# Altium project Pack_BMS_Module.PrjPcb
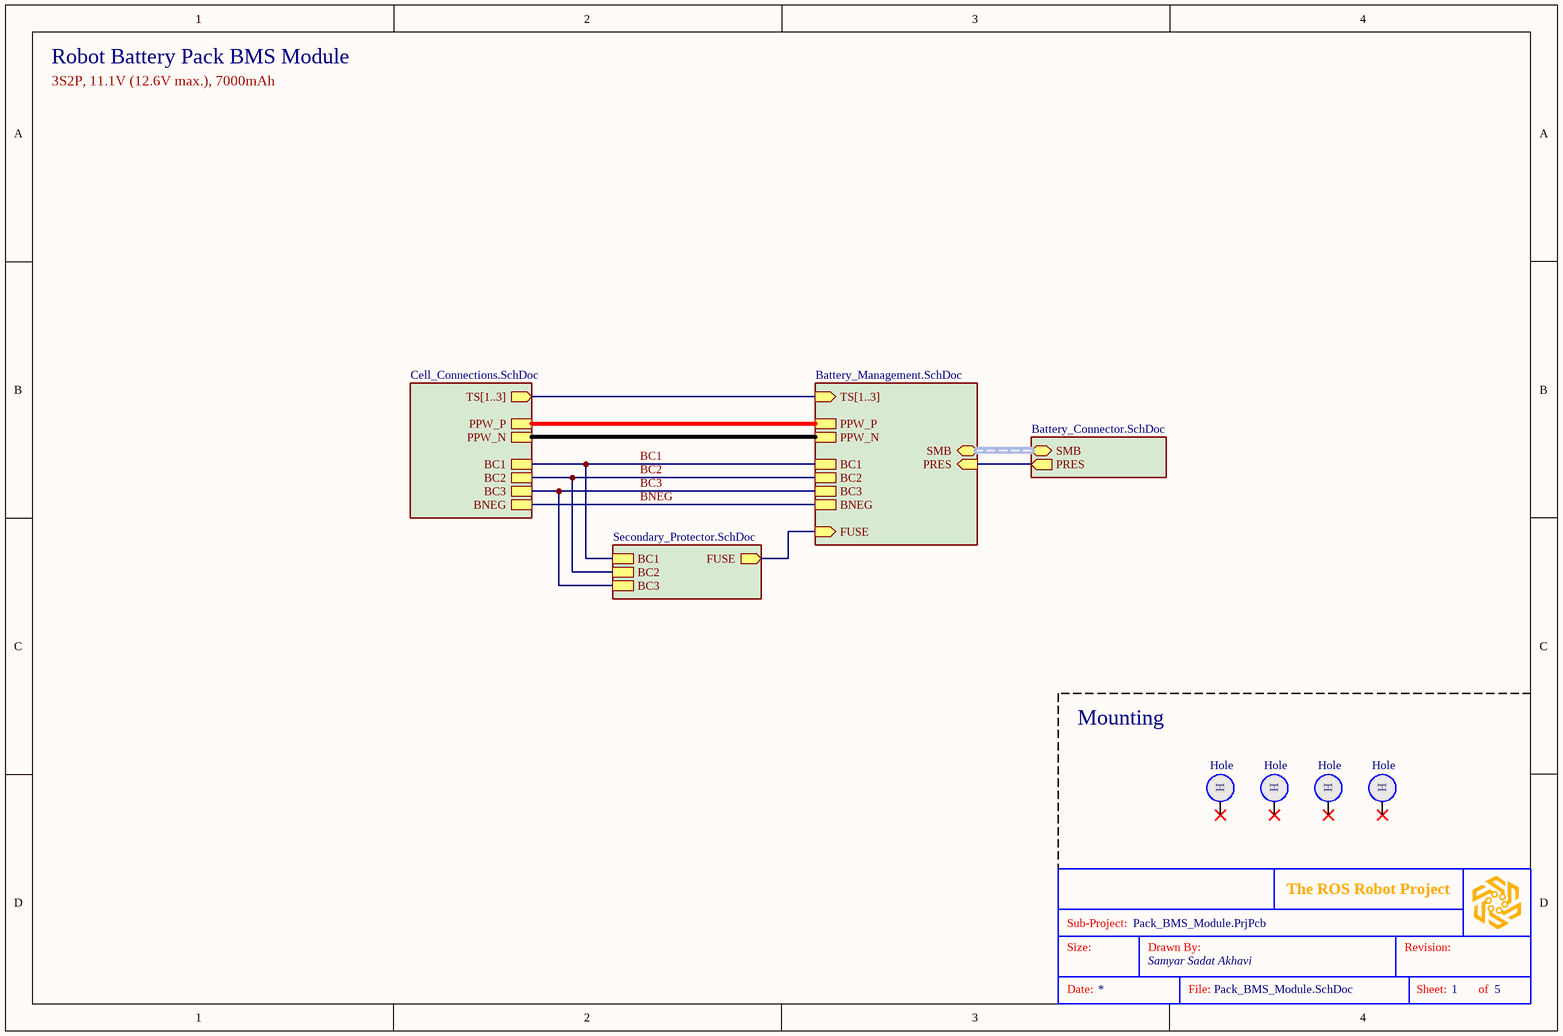
[diagram p0: Pack_BMS_Module.SchDoc]
MainProjectName: The ROS Robot Project
5 sheets, 99 parts. Net scope: hierarchical (ports join the sheet entries above them; power ports are global).
Board file: Pack_BMS_Module.PcbDoc
Sheets:
  Pack_BMS_Module.SchDoc
    CELL_CONN = Cell_Connections.SchDoc
    BATT_MGMT = Battery_Management.SchDoc
    SEC_PROT = Secondary_Protector.SchDoc
    BATT_CONN = Battery_Connector.SchDoc

## Sheet Pack_BMS_Module.SchDoc: =SheetTitle
size A4; SheetTitle: Pack BMS Module; DrawnBy: Samyar Sadat Akhavi; SheetNumber: 1; SheetTotal: 5

### Parts
(Parts that share a designator on the sheet are numbered #1, #2 ... from top to bottom, then left to right.)
?#1  (no value)  (graphical)
MHL1  Hole  [Hole_2.6mm]  (no BOM)
MHL2  Hole  [Hole_2.6mm]  (no BOM)
MHL3  Hole  [Hole_2.6mm]  (no BOM)
MHL4  Hole  [Hole_2.6mm]  (no BOM)

### Sub-sheets
BATT_CONN = Battery_Connector.SchDoc: PRES (out), SMB (bidir, harness SMBus)
BATT_MGMT = Battery_Management.SchDoc: BC2, BC1, BNEG, BC3, FUSE (in), TS[1..3] (in), PPW_N, PPW_P, PRES (in), SMB (bidir, harness SMBus)
CELL_CONN = Cell_Connections.SchDoc: BC1, BC2, BC3, BNEG, TS[1..3] (out), PPW_N, PPW_P
SEC_PROT = Secondary_Protector.SchDoc: BC2, BC1, BC3, FUSE (out)

### Nets
BC1: sheet CELL_CONN/BC1, sheet BATT_MGMT/BC1, sheet SEC_PROT/BC1
BC2: sheet CELL_CONN/BC2, sheet BATT_MGMT/BC2, sheet SEC_PROT/BC2
BC3: sheet CELL_CONN/BC3, sheet BATT_MGMT/BC3, sheet SEC_PROT/BC3
BNEG: sheet CELL_CONN/BNEG, sheet BATT_MGMT/BNEG
PPW_N: sheet CELL_CONN/PPW_N, sheet BATT_MGMT/PPW_N
PPW_P: sheet CELL_CONN/PPW_P, sheet BATT_MGMT/PPW_P
NetR1_2: sheet BATT_MGMT/PRES, sheet BATT_CONN/PRES
NetR16_1: sheet BATT_MGMT/FUSE, sheet SEC_PROT/FUSE

Not connected (* = marked no-connect by the designer): MHL1 1*; MHL2 1*; MHL3 1*; MHL4 1*

### Buses and harness runs
bus sheet BATT_MGMT/TS[1..3] = sheet CELL_CONN/TS[1..3]
harness sheet BATT_CONN/SMB = sheet BATT_MGMT/SMB

### Notes on the sheet
- Robot Battery Pack BMS Module
- 3S2P, 11.1V (12.6V max.), 7000mAh
- Mounting
- Sub-Project:
- Size:
- Drawn By:
- Revision:
- Date:
- File:
- Sheet:
- of
- (in symbol GEN-PCBMHL2S6) H

### Library data of the parts
?#1 = SGR-STDTBSA4: STANDARD SCHEMATICS TITLE BLOCK
MHL1-MHL4 = GEN-PCBMHL2S6: CIRCULAR PCB MOUNTING HOLE; Part Number: GEN-PCBMHL2S6; Size Variant: 2.6mm

## Sheet Cell_Connections.SchDoc: =SheetTitle
size A4; SheetTitle: Cell Connections; DrawnBy: Samyar Sadat Akhavi
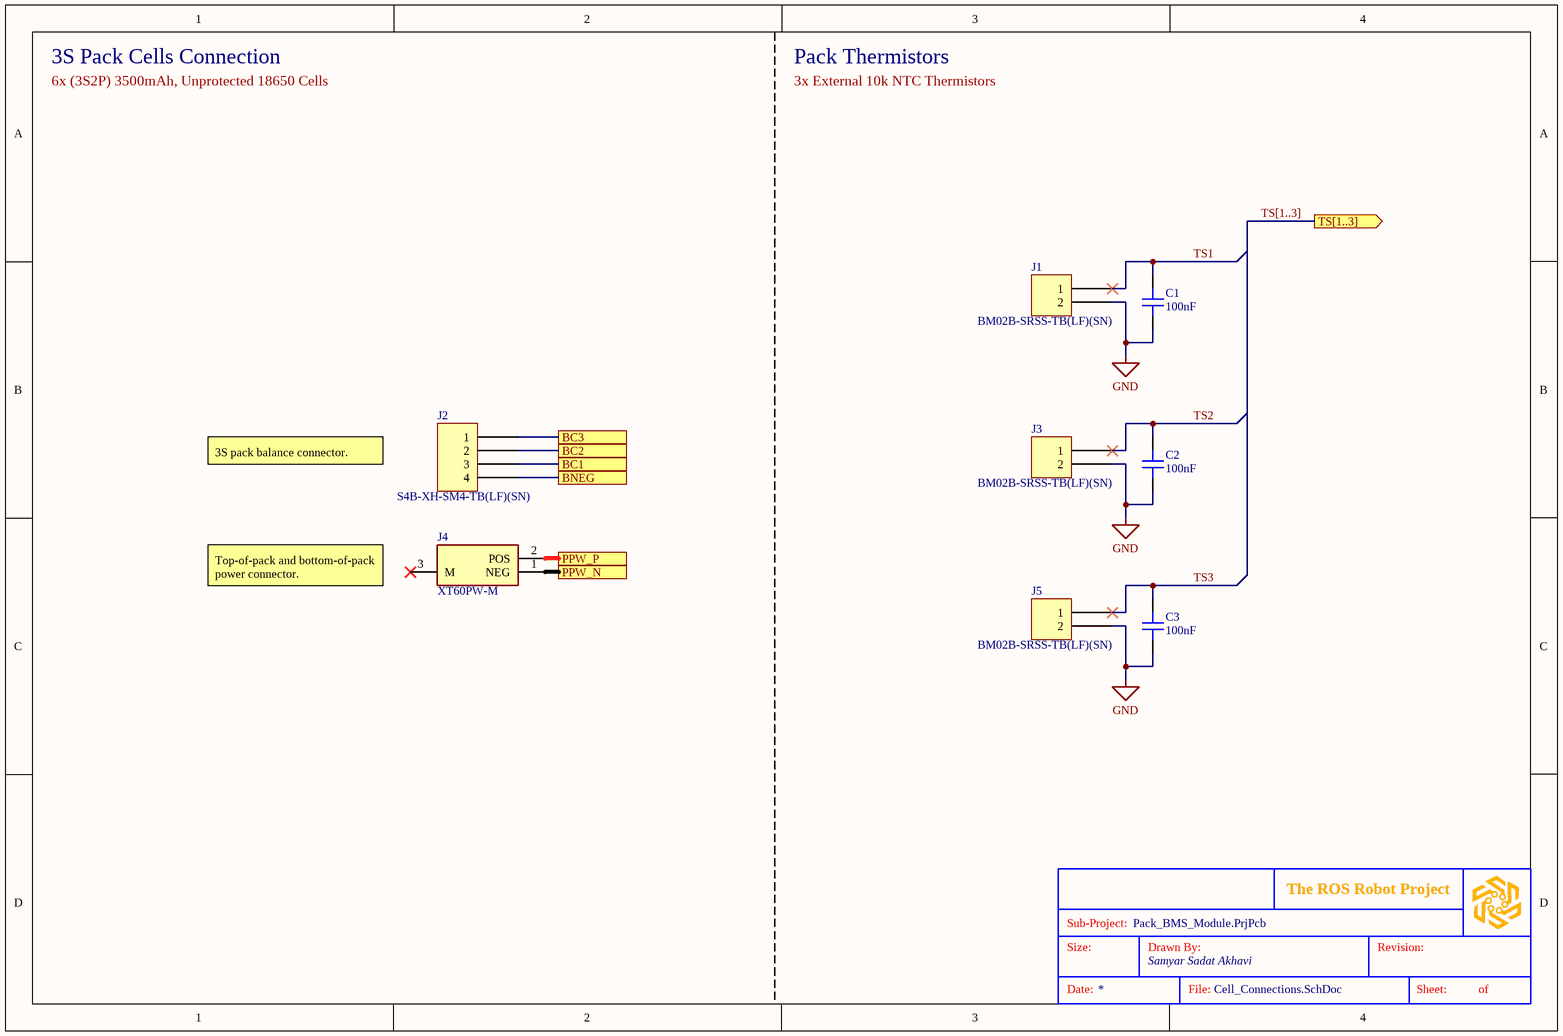
[diagram p1: Cell_Connections.SchDoc]

### Parts
(Parts that share a designator on the sheet are numbered #1, #2 ... from top to bottom, then left to right.)
?#2  (no value)  (graphical)
C1  100nF  [CAP 0603_1608]
C2  100nF  [CAP 0603_1608]
C3  100nF  [CAP 0603_1608]
J1  BM02B-SRSS-TB(LF)(SN)  [JST BM02B-SRSS-TB]
J2  S4B-XH-SM4-TB(LF)(SN)  [JST XH S4B-XH-SM4-TB]
J3  BM02B-SRSS-TB(LF)(SN)  [JST BM02B-SRSS-TB]
J4  XT60PW-M  [XT60PWM]
J5  BM02B-SRSS-TB(LF)(SN)  [JST BM02B-SRSS-TB]

### Ports
BC1 (see Pack_BMS_Module[2B], Battery_Management[1C], Secondary_Protector[2C]), BC2 (see Pack_BMS_Module[2B], Battery_Management[1C], Secondary_Protector[2B]), BC3 (see Pack_BMS_Module[2B], Battery_Management[1C], Secondary_Protector[2B]), BNEG (see Pack_BMS_Module[2B], Battery_Management[1C]), PPW_N (see Pack_BMS_Module[2B], Battery_Management[1C]), PPW_P (see Pack_BMS_Module[2B], Battery_Management[1C]), TS[1..3] (out, see Pack_BMS_Module[2B], Battery_Management[4C])

### Nets
GND: C1.1 C2.1 C3.1 J1.2 J3.2 J5.2
BC1: J2.3 ; port BC1
BC2: J2.2 ; port BC2
BC3: J2.1 ; port BC3
BNEG: J2.4 ; port BNEG
PPW_N: J4.1(NEG) ; port PPW_N
PPW_P: J4.2(POS) ; port PPW_P
TS1: C1.2 J1.1
TS2: C2.2 J3.1
TS3: C3.2 J5.1

Not connected (* = marked no-connect by the designer): J4 3(M)*

### Buses and harness runs
bus TS[1..3] = port TS[1..3]

### Notes on the sheet
- 3S Pack Cells Connection
- 6x (3S2P) 3500mAh, Unprotected 18650 Cells
- Pack Thermistors
- 3x External 10k NTC Thermistors
- 3S pack balance connector.
- Top-of-pack and bottom-of-pack power connector.
- Sub-Project:
- Size:
- Drawn By:
- Revision:
- Date:
- File:
- Sheet:
- of

### Library data of the parts
?#2 = SGR-STDTBSA4: STANDARD SCHEMATICS TITLE BLOCK
C1-C3 = GEN-CC100NT10V25KX7R603: GENERIC 0603 MLC CAPACITOR; Tolerance: ±10%; Voltage: 25V; Dielectric: X7R; Part Number: GEN-CC100NT10V25KX7R603; Value: 100nF
J1 J3 J5 = BM02B-SRSS-TB(LF)(SN): CONN HEADER SMD 2POS 1MM; Manufacturer: JST Sales America Inc.; Current Rating (Amps): 0.7A; Material Flammability Rating: UL94 V-0; Number of Positions: 2; Number of Positions Loaded: All; Pitch - Mating: 0.039" (1.00mm); Shrouding: Shrouded - 4 Wall; Style: Board to Cable/Wire; Voltage Rating: 50V; Part Number: BM02B-SRSS-TB(LF)(SN); ComponentLink1Description: Datasheet; ComponentLink1URL: http://www.jst-mfg.com/product/pdf/eng/eSR.pdf; ComponentLink2Description: DigiKey Link; ComponentLink2URL: http://digikey.com/product-detail/en/jst-sales-america-inc/BM02B-SRSS-TB-LF-SN/455-1788-1-ND/926859; Connector Type: Header; Contact Finish - Mating: Tin; Contact Finish - Post: Tin; Contact Material: Copper Alloy; Contact Shape: Square; Contact Type: Male Pin; Fastening Type: Push-Pull; Features: Solder Retention; Insulation Color: Natural; Insulation Height: 0.167" (4.25mm); Insulation Material: Polyamide (PA), Nylon; LastUpdated: 1/12/2020 10:11:04 PM; Lifecycle Status: Active; Minimum Order: 1; Mounting Type: Surface Mount; Number of Rows: 1; Operating Temperature: -25°C ~ 85°C; Packaging: TapeAndReel; PartId: 12; Part Status: Active; Price: 0.22; Series: SR; Supplier 1: DigiKey; Supplier Part Number 1: 455-1788-1-ND; Termination: Solder
J2 = S4B-XH-SM4-TB(LF)(SN): CONN HEADER SMD R/A 4POS 2.5MM; Manufacturer: JST Sales America Inc.; Current Rating (Amps): 3A; Material Flammability Rating: UL94 V-0; Number of Positions: 4; Number of Positions Loaded: All; Pitch - Mating: 0.098" (2.50mm); Row Spacing - Mating: -25°C ~ 85°C; Shrouding: Shrouded - 4 Wall; Style: Board to Cable/Wire; Part Number: S4B-XH-SM4-TB(LF)(SN); ComponentLink1Description: Datasheet; ComponentLink1URL: http://www.jst-mfg.com/product/pdf/eng/eXH.pdf; ComponentLink2Description: DigiKey Link; ComponentLink2URL: http://digikey.com/product-detail/en/jst-sales-america-inc/S4B-XH-SM4-TB-LF-SN/455-2262-1-ND/1651060; Connector Type: Header; Contact Finish - Mating: Tin; Contact Finish - Post: Tin; Contact Material: Copper Alloy; Contact Shape: Square; Contact Type: Male Pin; Fastening Type: Detent Lock; Features: Solder Retention; Insulation Color: Natural; Insulation Height: 0.236" (6.00mm); Insulation Material: Polyamide (PA6T), Nylon 6T; LastUpdated: 8/29/2025 7:06:32 AM; Lifecycle Status: Active; Minimum Order: 1; Mounting Type: Surface Mount, Right Angle; Number of Rows: 1; Operating Temperature: -25°C ~ 85°C; Packaging: TapeAndReel; PartId: 191; Part Status: Active; Price: 0.49; Series: XH; Supplier 1: DigiKey; Supplier Part Number 1: 455-2262-1-ND; Termination: Solder
J4 = XT60PW-M: MALE XT60 PCB-MOUNT SOLDERABLE CONNECTOR; Manufacturer: AMASS; Part Number: XT60PW-M; Supplier 1: TME; Supplier Part Number 1: XT60PW-M

## Sheet Battery_Management.SchDoc: =SheetTitle
size A3; SheetTitle: Battery Management; DrawnBy: Samyar Sadat Akhavi
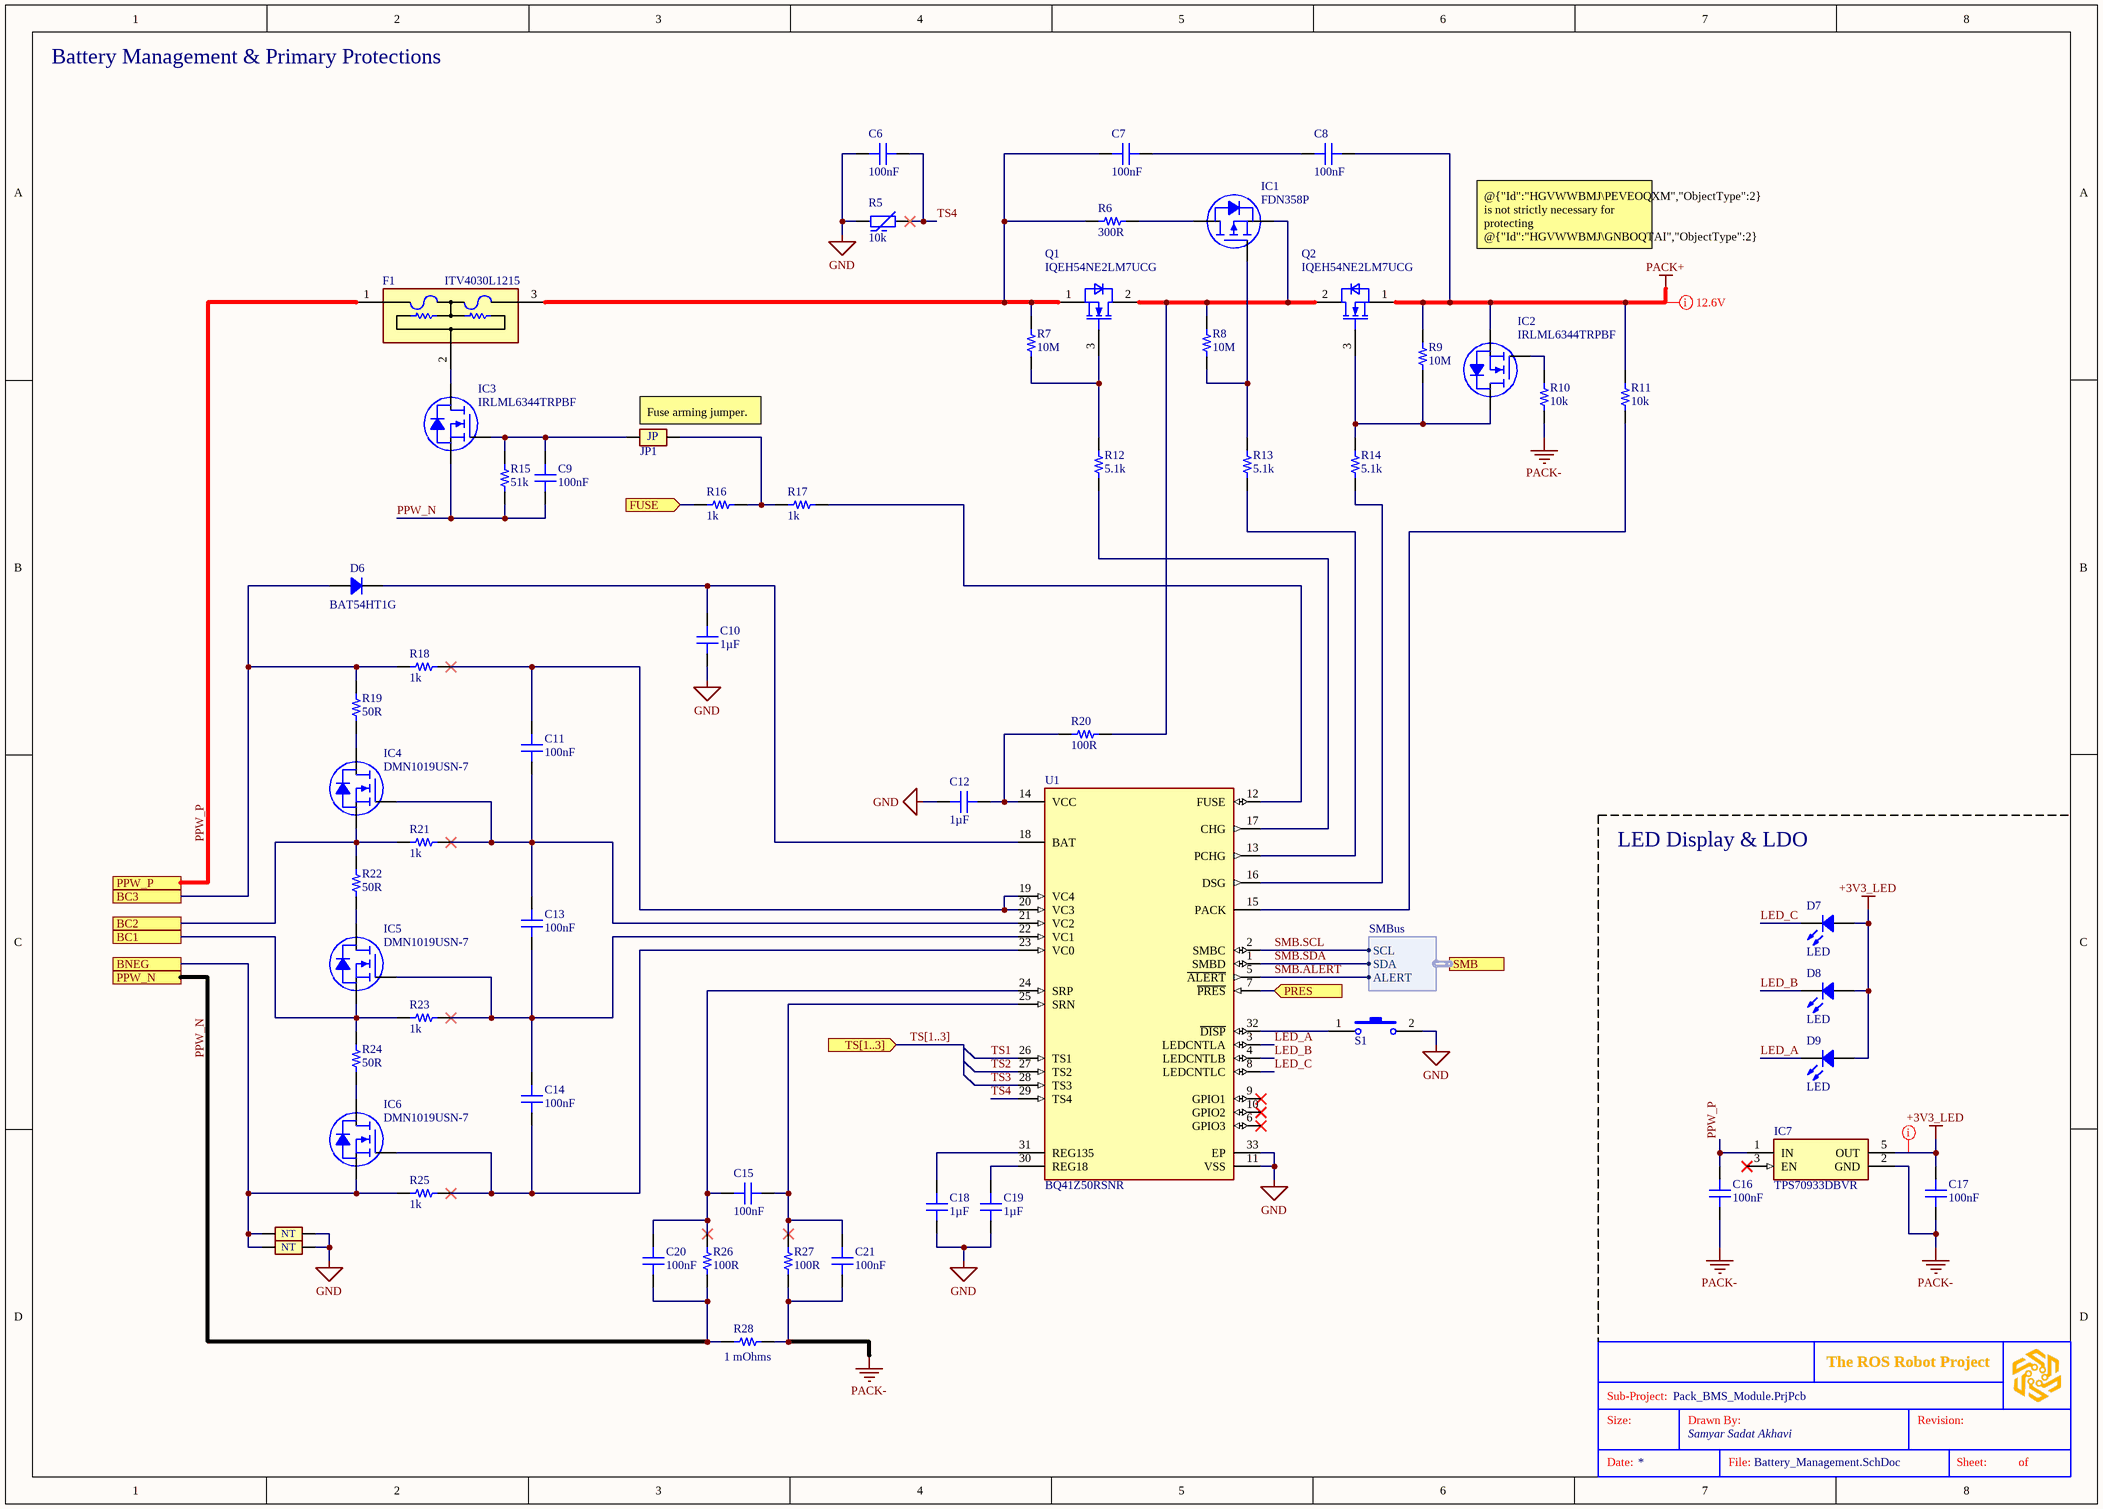
[diagram p2: Battery_Management.SchDoc]

### Parts
(Parts that share a designator on the sheet are numbered #1, #2 ... from top to bottom, then left to right.)
?#3  (no value)  (graphical)
C6  100nF  [CAP 0603_1608]
C7  100nF  [CAP 0603_1608]
C8  100nF  [CAP 0603_1608]
C9  100nF  [CAP 0603_1608]
C10  1µF  [CAP 0805_2012]
C11  100nF  [CAP 0603_1608]
C12  1µF  [CAP 0805_2012]
C13  100nF  [CAP 0603_1608]
C14  100nF  [CAP 0603_1608]
C15  100nF  [CAP 0603_1608]
C16  100nF  [CAP 0603_1608]
C17  100nF  [CAP 0603_1608]
C18  1µF  [CAP 0805_2012]
C19  1µF  [CAP 0805_2012]
C20  100nF  [CAP 0603_1608]
C21  100nF  [CAP 0603_1608]
D6  BAT54HT1G  [SOD323 IPC]
D7  LED  [LED 0805_2012]
D8  LED  [LED 0805_2012]
D9  LED  [LED 0805_2012]
F1  ITV4030L1215  [ITV4030L1215]
IC1  FDN358P  [ON SEMI SOT-23-3]
IC2  IRLML6344TRPBF  [INFINEON SOT-23-3]
IC3  IRLML6344TRPBF  [INFINEON SOT-23-3]
IC4  DMN1019USN-7  [DIODES SOT-23-3]
IC5  DMN1019USN-7  [DIODES SOT-23-3]
IC6  DMN1019USN-7  [DIODES SOT-23-3]
IC7  TPS70933DBVR  [SOT95P280X145-5N]
JP1  Jumper Pad  [Jumper_Pad]  (value not drawn)  (no BOM)
NT1  Net Tie  [Net_Tie_1.5mm]  (value not drawn)  (net tie, no BOM)
NT2  Net Tie  [Net_Tie_1.5mm]  (value not drawn)  (net tie, no BOM)
Q1  IQEH54NE2LM7UCG  [IFX-PG-TTFN-9-1-V]
Q2  IQEH54NE2LM7UCG  [IFX-PG-TTFN-9-1-V]
R5  10k  [NTC 0603_1608]
R6  300R  [RES 0603_1608]
R7  10M  [RES 0603_1608]
R8  10M  [RES 0603_1608]
R9  10M  [RES 0603_1608]
R10  10k  [RES 0603_1608]
R11  10k  [RES 0603_1608]
R12  5.1k  [RES 0603_1608]
R13  5.1k  [RES 0603_1608]
R14  5.1k  [RES 0603_1608]
R15  51k  [RES 0603_1608]
R16  1k  [RES 0603_1608]
R17  1k  [RES 0603_1608]
R18  1k  [RES 0603_1608]
R19  50R  [RES 1206_3216]
R20  100R  [RES 0603_1608]
R21  1k  [RES 0603_1608]
R22  50R  [RES 1206_3216]
R23  1k  [RES 0603_1608]
R24  50R  [RES 1206_3216]
R25  1k  [RES 0603_1608]
R26  100R  [RES 0603_1608]
R27  100R  [RES 0603_1608]
R28  1 mOhms  [RES 2512_6432]
S1  PTS815SJK250SMTRLFS  [PTS815SJK250SMTRLFS]  (value not drawn)
U1  BQ41Z50RSNR  [QFN32_RSN_TEX]

### Ports
BC1 (see Pack_BMS_Module[3B], Cell_Connections[2B], Secondary_Protector[2C]), BC2 (see Pack_BMS_Module[3B], Cell_Connections[2B], Secondary_Protector[2B]), BC3 (see Pack_BMS_Module[3B], Cell_Connections[2B], Secondary_Protector[2B]), BNEG (see Pack_BMS_Module[3B], Cell_Connections[2B]), FUSE (in, see Pack_BMS_Module[3C], Secondary_Protector[3B]), PPW_N (see Pack_BMS_Module[3B], Cell_Connections[2C]), PPW_P (see Pack_BMS_Module[3B], Cell_Connections[2C]), PRES (in, see Pack_BMS_Module[3B], Battery_Connector[2B]), SMB (harness SMBus, see Pack_BMS_Module[3B], Battery_Connector[1B]), TS[1..3] (in, see Pack_BMS_Module[3B], Cell_Connections[4A])

### Harnesses
SMBus: ALERT, SDA, SCL

### Nets
+3V3_LED: C17.2 D7.1(A) D8.1(A) D9.1(A) IC7.5(OUT)
GND: C6.2 C10.1 C12.2 C18.1 C19.1 NT1.2 NT2.2 R5.1 S1.2(NO) U1.11(VSS) U1.33(EP)
PACK+: C8.1 IC2.2(S) Q2.1(SOURCE) R9.2 R11.2
PACK-: C16.1 C17.1 C21.1 IC7.2(GND) R10.1 R27.1 R28.2
BC1: IC5.2(S) R23.1 R24.2 ; port BC1
BC2: IC4.2(S) R21.1 R22.2 ; port BC2
BC3: D6.2 R18.1 R19.2 ; port BC3
BNEG: IC6.2(S) NT1.1 NT2.1 R25.1 ; port BNEG
LED_A: D9.2(K) U1.3(LEDCNTLA)
LED_B: D8.2(K) U1.4(LEDCNTLB)
LED_C: D7.2(K) U1.8(LEDCNTLC)
PPW_N: C9.1 C20.1 IC3.2(S) R15.1 R26.1 R28.1 ; port PPW_N
PPW_P: C16.2 F1.1(FUSE_1) IC7.1(IN) ; port PPW_P
SMB.ALERT: U1.5(~{ALERT}) ; port SMB.ALERT
SMB.SCL: U1.2(SMBC) ; port SMB.SCL
SMB.SDA: U1.1(SMBD) ; port SMB.SDA
TS1: U1.26(TS1)
TS2: U1.27(TS2)
TS3: U1.28(TS3)
TS4: C6.1 R5.2 U1.29(TS4)
NetC7_1: C7.1 C8.2
NetC7_2: C7.2 F1.3(FUSE_2) Q1.1(SOURCE) R6.1 R7.2
NetC9_2: C9.2 IC3.1(G) JP1.1 R15.2
NetC10_2: C10.2 D6.1 U1.18(BAT)
NetC11_1: C11.1 C13.2 IC4.1(G) R21.2 U1.21(VC2)
NetC11_2: C11.2 R18.2 U1.19(VC4) U1.20(VC3)
NetC12_1: C12.1 R20.2 U1.14(VCC)
NetC13_1: C13.1 C14.2 IC5.1(G) R23.2 U1.22(VC1)
NetC14_1: C14.1 IC6.1(G) R25.2 U1.23(VC0)
NetC15_1: C15.1 C21.2 R27.2 U1.25(SRN)
NetC15_2: C15.2 C20.2 R26.2 U1.24(SRP)
NetC18_2: C18.2 U1.31(REG135)
NetC19_2: C19.2 U1.30(REG18)
NetF1_2: F1.2(HEATER) IC3.3(D)
NetIC1_1: IC1.1(G) R8.1 R13.2
NetIC1_2: IC1.2(S) Q1.2(DRAIN) Q2.2(DRAIN) R8.2 R20.1
NetIC1_3: IC1.3(D) R6.2
NetIC2_1: IC2.1(G) R10.2
NetIC2_3: IC2.3(D) Q2.3(GATE) R9.1 R14.2
NetIC4_3: IC4.3(D) R19.1
NetIC5_3: IC5.3(D) R22.1
NetIC6_3: IC6.3(D) R24.1
NetJP1_2: JP1.2 R16.2 R17.1
NetQ1_3: Q1.3(GATE) R7.1 R12.2
NetR1_2: U1.7(~{PRES}) ; port PRES
NetR11_1: R11.1 U1.15(PACK)
NetR12_1: R12.1 U1.17(CHG)
NetR13_1: R13.1 U1.13(PCHG)
NetR14_1: R14.1 U1.16(DSG)
NetR16_1: R16.1 ; port FUSE
NetR17_2: R17.2 U1.12(FUSE)
NetS1_1: S1.1(COM) U1.32(~{DISP})

Not connected (* = marked no-connect by the designer): IC7 3(EN)*; U1 6(GPIO3)* 9(GPIO1)* 10(GPIO2)*

### Buses and harness runs
bus TS[1..3] = port TS[1..3]

### Layout directives
rule Supply Nets [Voltage = 12.60]: PACK+
rule Supply Nets [Voltage = 3.300]: +3V3_LED

### Notes on the sheet
- Battery Management & Primary Protections
- @{"Id":"HGVWWBMJ\PEVEOQXM","ObjectType":2} is not strictly necessary for protecting @{"Id":"HGVWWBMJ\GNBOQTAI","ObjectType":2} from reverse charger connection, as @{"Id":"HGVWWBMJ\GNBOQTAI","ObjectType":2} is rated for Vgs ±16V.
- (near JP1) Fuse arming jumper.
- LED Display & LDO
- Sub-Project:
- Size:
- Drawn By:
- Revision:
- Date:
- File:
- Sheet:
- of
- (in symbol GEN-PCBSJPS2) JP
- (in symbol GEN-PCBTRNT1S5) NT

### Library data of the parts
?#3 = SGR-STDTBSA3: STANDARD SCHEMATICS TITLE BLOCK
C6-C9 C11 C13-C17 C20 C21 = GEN-CC100NT10V25KX7R603: as C1 on sheet Cell_Connections; Part Number: GEN-CC100NT10V25KX7R603; Value: 100nF
C10 C12 C18 C19 = GEN-CC1UT10V25KX7R805: GENERIC 0805 MLC CAPACITOR; Tolerance: ±10%; Voltage: 25V; Dielectric: X7R; Part Number: GEN-CC1UT10V25KX7R805; Value: 1µF
D6 = BAT54HT1G: DIODE SCHOTTKY 30V 200MA SOD323; Manufacturer: ON Semiconductor; Capacitance @ Vr, F: 10pF @ 1V, 1MHz; Current - Average Rectified (Io): 200mA (DC); Current - Reverse Leakage @ Vr: 2µA @ 25V; Reverse Recovery Time (trr): 5ns; Speed: Small Signal =< 200mA (Io), Any Speed; Voltage - Forward (Vf) (Max) @ If: 800mV @ 100mA; Part Number: BAT54HT1G; ComponentLink1Description: Datasheet; ComponentLink1URL: //media.digikey.com/pdf/Data%20Sheets/Fairchild%20PDFs/BAT54HT1G_Rev_1.2.pdf; ComponentLink2Description: DigiKey Link; ComponentLink2URL: http://digikey.com/product-detail/en/on-semiconductor/BAT54HT1G/BAT54HT1GOSCT-ND/917809; Diode Type: Schottky; LastUpdated: 4/5/2026 8:59:27 PM; Lifecycle Status: Active; Minimum Order: 1; Mounting Type: Surface Mount; Operating Temperature - Junction: -55°C ~ 150°C; Package / Case: SC-76, SOD-323; Packaging: TapeAndReel; PartId: 3080; Part Status: Active; Price: 0.03; Supplier 1: DigiKey; Supplier Part Number 1: BAT54HT1GOSCT-ND; Supplier Device Package: SOD-323; Voltage - DC Reverse (Vr) (Max): 30V
D7 = GEN-CILGRNLCLR805: GENERIC 0805 INDICATOR LED; Color: Green; Lens Color: Clear; Part Number: GEN-CILGRNLCLR805
D8 = GEN-CILAMBLCLR805: GENERIC 0805 INDICATOR LED; Color: Amber; Lens Color: Clear; Part Number: GEN-CILAMBLCLR805
D9 = GEN-CILREDLCLR805: GENERIC 0805 INDICATOR LED; Color: Red; Lens Color: Clear; Part Number: GEN-CILREDLCLR805
F1 = ITV4030L1215: FUSE BATTERY PROTECTOR 12V 15A; Manufacturer: Littelfuse Inc.; Voltage: 36VDC; Response Time: Fast Blow; Part Number: ITV4030L1215; Current Rating: 15A; Supplier 1: DigiKey; Supplier Part Number 1: 18-ITV4030L1215NRCT-ND
IC1 = FDN358P: MOSFET P-CH 30V 1.5A SSOT3; Manufacturer: ON Semiconductor; Current - Continuous Drain (Id) @ 25°C: 1.5A (Ta); Drive Voltage (Max Rds On,  Min Rds On): 4.5V, 10V; FET Type: P-Channel; Gate Charge (Qg) (Max) @ Vgs: 5.6nC @ 10V; Input Capacitance (Ciss) (Max) @ Vds: 182pF @ 15V; Power Dissipation (Max): 500mW (Ta); Rds On (Max) @ Id, Vgs: 125mOhm @ 1.5A, 10V; Vgs (Max): ±20V; Vgs(th) (Max) @ Id: 3V @ 250µA; Part Number: FDN358P; ComponentLink1Description: Datasheet; ComponentLink1URL: https://www.onsemi.com/pub/Collateral/FDN358P-D.PDF; ComponentLink2Description: DigiKey Link; ComponentLink2URL: http://digikey.com/product-detail/en/on-semiconductor/FDN358P/FDN358PCT-ND/965606; Drain to Source Voltage (Vdss): 30V; LastUpdated: 4/5/2026 8:53:33 PM; Lifecycle Status: Active; Minimum Order: 1; Mounting Type: Surface Mount; Operating Temperature: -55°C ~ 150°C (TJ); Package / Case: TO-236-3, SC-59, SOT-23-3; Packaging: TapeAndReel; Part Status: Active; Price: 0.11; Series: PowerTrench®; Supplier 1: DigiKey; Supplier Part Number 1: FDN358PCT-ND; Supplier Device Package: SuperSOT-3; Technology: MOSFET (Metal Oxide)
IC2 IC3 = IRLML6344TRPBF: MOSFET N-CH 30V 5A MICRO3/SOT23; Manufacturer: Infineon Technologies; Current - Continuous Drain (Id) @ 25°C: 5A (Ta); Drive Voltage (Max Rds On,  Min Rds On): 2.5V, 4.5V; FET Type: N-Channel; Gate Charge (Qg) (Max) @ Vgs: 6.8 nC @ 4.5 V; Input Capacitance (Ciss) (Max) @ Vds: 650 pF @ 25 V; Power Dissipation (Max): 1.3W (Ta); Rds On (Max) @ Id, Vgs: 29mOhm @ 5A, 4.5V; Vgs (Max): ±12V; Vgs(th) (Max) @ Id: 1.1V @ 10µA; Part Number: IRLML6344TRPBF; ComponentLink1Description: Datasheet; ComponentLink1URL: https://www.infineon.com/dgdl/irlml6344pbf.pdf?fileId=5546d462533600a4015356689c44262c; ComponentLink2Description: DigiKey Link; ComponentLink2URL: https://www.digikey.com/en/products/detail/infineon-technologies/IRLML6344TRPBF/2538152; Drain to Source Voltage (Vdss): 30 V; LastUpdated: 4/5/2026 8:53:29 PM; Lifecycle Status: Active; Minimum Order: 1; Mounting Type: Surface Mount; Operating Temperature: -55°C ~ 150°C (TJ); Package / Case: TO-236-3, SC-59, SOT-23-3; Packaging: TapeAndReel; Part Status: Active; Price: 0.09; Series: HEXFET®; Supplier 1: DigiKey; Supplier Part Number 1: IRLML6344TRPBFCT-ND; Supplier Device Package: Micro3™/SOT-23; Technology: MOSFET (Metal Oxide)
IC4-IC6 = DMN1019USN-7: MOSFET N-CH 12V 9.3A SC59; Manufacturer: Diodes Incorporated; Current - Continuous Drain (Id) @ 25°C: 9.3A (Ta); Drive Voltage (Max Rds On,  Min Rds On): 1.2V, 2.5V; FET Type: N-Channel; Gate Charge (Qg) (Max) @ Vgs: 50.6 nC @ 8 V; Input Capacitance (Ciss) (Max) @ Vds: 2426 pF @ 10 V; Power Dissipation (Max): 680mW (Ta); Rds On (Max) @ Id, Vgs: 10mOhm @ 9.7A, 4.5V; Vgs (Max): ±8V; Vgs(th) (Max) @ Id: 800mV @ 250µA; Part Number: DMN1019USN-7; ComponentLink1Description: Datasheet; ComponentLink1URL: https://www.diodes.com/assets/Datasheets/DMN1019USN.pdf; ComponentLink2Description: DigiKey Link; ComponentLink2URL: https://www.digikey.com/en/products/detail/diodes-incorporated/DMN1019USN-7/4898853; Drain to Source Voltage (Vdss): 12 V; LastUpdated: 4/5/2026 8:53:22 PM; Lifecycle Status: Active; Minimum Order: 1; Mounting Type: Surface Mount; Operating Temperature: -55°C ~ 150°C (TJ); Package / Case: TO-236-3, SC-59, SOT-23-3; Packaging: TapeAndReel; Part Status: Active; Price: 0.10; Series: -; Supplier 1: DigiKey; Supplier Part Number 1: DMN1019USN-7DICT-ND; Supplier Device Package: SC-59-3; Technology: MOSFET (Metal Oxide)
IC7 = TPS70933DBVR: IC REG LINEAR 3.3V 150MA SOT23-5; Manufacturer: Texas Instruments; Part Number: TPS70933DBVR; Supplier 1: DigiKey; Supplier Part Number 1: 296-35483-1-ND
JP1 = GEN-PCBSJPS2: CIRCULAR, SOLDERABLE JUMPER SELECTOR PAD; Part Number: GEN-PCBSJPS2; Size Variant: 2mm
NT1 NT2 = GEN-PCBTRNT1S5: TRACK STYLE RECTANGULAR NET TIE; Part Number: GEN-PCBTRNT1S5; Size Variant: 1.5mm
Q1 Q2 = IQEH54NE2LM7UCG: IGFET, N-CHANNEL, ENHANCEMENT, BODY DIODE; Manufacturer: Infineon Technologies; Part Number: IQEH54NE2LM7UCG; Supplier 1: DigiKey; Supplier Part Number 1: 448-IQEH54NE2LM7UCGATMA1CT-ND
R5 = NTCGS163JX103DT8: NTC,10K,0.5%,0603,150C,AEC-Q200,; Manufacturer: TDK Corporation; B25/100: 3453K; B25/50: 3380K; B25/75: 3422K; B25/85: 3435K; B Value Tolerance: ±0.7%; Power - Max: 125 mW; Part Number: NTCGS163JX103DT8; ComponentLink1Description: Datasheet; ComponentLink1URL: https://product.tdk.com/system/files/dam/doc/product/sensor/ntc/chip-ntc-thermistor/catalog/tpd_automotive_ntc-thermistor_ntcgs_en.pdf; ComponentLink2Description: DigiKey Link; ComponentLink2URL: https://www.digikey.com/en/products/detail/tdk-corporation/NTCGS163JX103DT8/22260965; Device Package: 0603 (1608 Metric); LastUpdated: 4/5/2026 8:42:58 PM; Lifecycle Status: Active; Minimum Order: 1; Mounting Type: Surface Mount; Operating Temperature: -55°C ~ 150°C; Package / Case: 0603 (1608 Metric); Packaging: TapeAndReel; PartId: 2194; Price: 0.15; Resistance in Ohms @ 25°C: 10k; Resistance Tolerance: ±0.5%; Series: NTCGS; Supplier 1: DigiKey; Supplier Part Number 1: 445-NTCGS163JX103DT8CT-ND; Value: 10k
R6 = GEN-CRR300T5P8603: GENERIC 0603 CHIP RESISTOR; Tolerance: ±5%; Power: 0.125W; Part Number: GEN-CRR300T5P8603; Value: 300R
R7-R9 = GEN-CRR10MT5P8603: GENERIC 0603 CHIP RESISTOR; Tolerance: ±5%; Power: 0.125W; Part Number: GEN-CRR10MT5P8603; Value: 10M
R10 R11 = GEN-CRR10KT5P8603: GENERIC 0603 CHIP RESISTOR; Tolerance: ±5%; Power: 0.125W; Part Number: GEN-CRR10KT5P8603; Value: 10k
R12-R14 = GEN-CRR5K1T5P8603: GENERIC 0603 CHIP RESISTOR; Tolerance: ±5%; Power: 0.125W; Part Number: GEN-CRR5K1T5P8603; Value: 5.1k
R15 = GEN-CRR51KT5P8603: GENERIC 0603 CHIP RESISTOR; Tolerance: ±5%; Power: 0.125W; Part Number: GEN-CRR51KT5P8603; Value: 51k
R16-R18 R21 R23 R25 = GEN-CRR1KT1P8603: GENERIC 0603 CHIP RESISTOR; Tolerance: ±1%; Power: 0.125W; Part Number: GEN-CRR1KT1P8603; Value: 1k
R19 R22 R24 = GEN-CRR50T1P11206: GENERIC 1206 CHIP RESISTOR; Tolerance: ±1%; Power: 1W; Part Number: GEN-CRR50T1P11206; Value: 50R
R20 R26 R27 = GEN-CRR100T1P8603: GENERIC 0603 CHIP RESISTOR; Tolerance: ±1%; Power: 0.125W; Part Number: GEN-CRR100T1P8603; Value: 100R
R28 = TLR3A20DR001FTDG: RES 0.001 OHM 1% 2W 2512; manufacturer: TE Connectivity Passive Product; Temperature Coefficient: ±50ppm/°C; Part Number: TLR3A20DR001FTDG; componentlink1description: Datasheet; componentlink1url: https://www.te.com/commerce/DocumentDelivery/DDEController?Action=srchrtrv&DocNm=1773449-3&DocType=DS&DocLang=English; componentlink2description: DigiKey Link; componentlink2url: http://digikey.com/product-detail/en/te-connectivity-passive-product/TLR3A20DR001FTDG/A129565CT-ND/8566769; Composition: Metal Foil; Device Package: 2512 (6432 Metric); Features: Current Sense; Height - Seated (Max): 0.024" (0.60mm); lastupdated: 9/2/2020 1:27:06 AM; Lifecycle Status: Active; Minimum Order: 1; Number of Terminations: 2; Operating Temperature: -55°C ~ 170°C; Package / Case: 2512 (6432 Metric); packaging: TapeAndReel; Part Status: Active; Power (Watts): 2W; price: 0.30; Resistance: 1 mOhms; series: TLR, CGS; Size / Dimension: 0.252" L x 0.126" W (6.40mm x 3.20mm); Supplier 1: DigiKey; Supplier Part Number 1: A129565CT-ND; Supplier Device Package: 2512; Tolerance: ±1%; value: 1 mOhms
S1 = PTS815SJK250SMTRLFS: SWITCH TACTILE SPST-NO 0.05A 12V; Manufacturer: C&K; Part Number: PTS815SJK250SMTRLFS; Circuit: SPST-NO; Supplier 1: DigiKey; Supplier Part Number 1: CKN12216-1-ND
U1 = BQ41Z50RSNR: 2 TO 4 SERIES LI-ION HIGHLY INTE; Manufacturer: Texas Instruments; Copyright: Copyright (C) 2025 Ultra Librarian. All rights reserved.; Part Number: BQ41Z50RSNR; Supplier 1: DigiKey; Supplier Part Number 1: 296-BQ41Z50RSNRCT-ND

## Sheet Secondary_Protector.SchDoc: =SheetTitle
size A4; SheetTitle: Secondary Battery Protections; DrawnBy: Samyar Sadat Akhavi; SheetNumber: 4; SheetTotal: 5
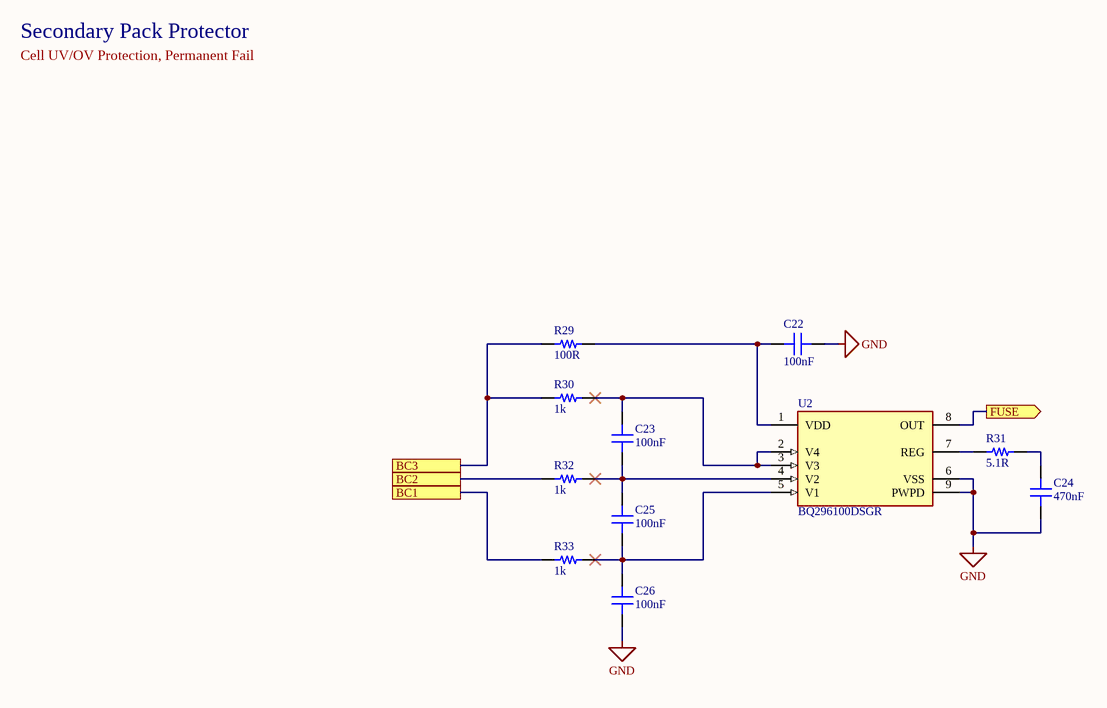
[diagram p3: Secondary_Protector.SchDoc]

### Parts
(Parts that share a designator on the sheet are numbered #1, #2 ... from top to bottom, then left to right.)
?#4  (no value)  (graphical)
C22  100nF  [CAP 0603_1608]
C23  100nF  [CAP 0603_1608]
C24  470nF  [CAP 0603_1608]
C25  100nF  [CAP 0603_1608]
C26  100nF  [CAP 0603_1608]
R29  100R  [RES 0603_1608]
R30  1k  [RES 0603_1608]
R31  5.1R  [RES 0603_1608]
R32  1k  [RES 0603_1608]
R33  1k  [RES 0603_1608]
U2  BQ296100DSGR  [DSG0008A]

### Ports
BC1 (see Pack_BMS_Module[2C], Battery_Management[1C], Cell_Connections[2B]), BC2 (see Pack_BMS_Module[2C], Battery_Management[1C], Cell_Connections[2B]), BC3 (see Pack_BMS_Module[2C], Battery_Management[1C], Cell_Connections[2B]), FUSE (out, see Pack_BMS_Module[2C], Battery_Management[3B])

### Nets
GND: C22.1 C24.1 C26.1 U2.6(VSS) U2.9(PWPD)
BC1: R33.1 ; port BC1
BC2: R32.1 ; port BC2
BC3: R29.2 R30.1 ; port BC3
NetC22_2: C22.2 R29.1 U2.1(VDD)
NetC23_1: C23.1 C25.2 R32.2 U2.4(V2)
NetC23_2: C23.2 R30.2 U2.2(V4) U2.3(V3)
NetC24_2: C24.2 R31.2
NetC25_1: C25.1 C26.2 R33.2 U2.5(V1)
NetR16_1: U2.8(OUT) ; port FUSE
NetR31_1: R31.1 U2.7(REG)

### Notes on the sheet
- Secondary Pack Protector
- Cell UV/OV Protection, Permanent Fail
- Sub-Project:
- Size:
- Drawn By:
- Revision:
- Date:
- File:
- Sheet:
- of

### Library data of the parts
?#4 = SGR-STDTBSA4: STANDARD SCHEMATICS TITLE BLOCK
C22 C23 C25 C26 = GEN-CC100NT10V25KX7R603: as C1 on sheet Cell_Connections; Part Number: GEN-CC100NT10V25KX7R603; Value: 100nF
C24 = GEN-CC470NT10V16KX7R603: GENERIC 0603 MLC CAPACITOR; Tolerance: ±10%; Voltage: 16V; Dielectric: X7R; Part Number: GEN-CC470NT10V16KX7R603; Value: 470nF
R29 = GEN-CRR100T1P8603: as R20 on sheet Battery_Management; Part Number: GEN-CRR100T1P8603; Value: 100R
R30 R32 R33 = GEN-CRR1KT1P8603: as R16 on sheet Battery_Management; Part Number: GEN-CRR1KT1P8603; Value: 1k
R31 = GEN-CRR5R1T1P8603: GENERIC 0603 CHIP RESISTOR; Tolerance: ±1%; Power: 0.125W; Part Number: GEN-CRR5R1T1P8603; Value: 5.1R
U2 = BQ296100DSGR: IC BATT PROT LI-ION 2-4CEL 8WSON; Manufacturer: Texas Instruments; Part Number: BQ296100DSGR; Supplier 1: DigiKey; Supplier Part Number 1: 296-50964-1-ND

## Sheet Battery_Connector.SchDoc: =SheetTitle
size A4; SheetTitle: Battery Connector; DrawnBy: Samyar Sadat Akhavi; SheetNumber: 5; SheetTotal: 5
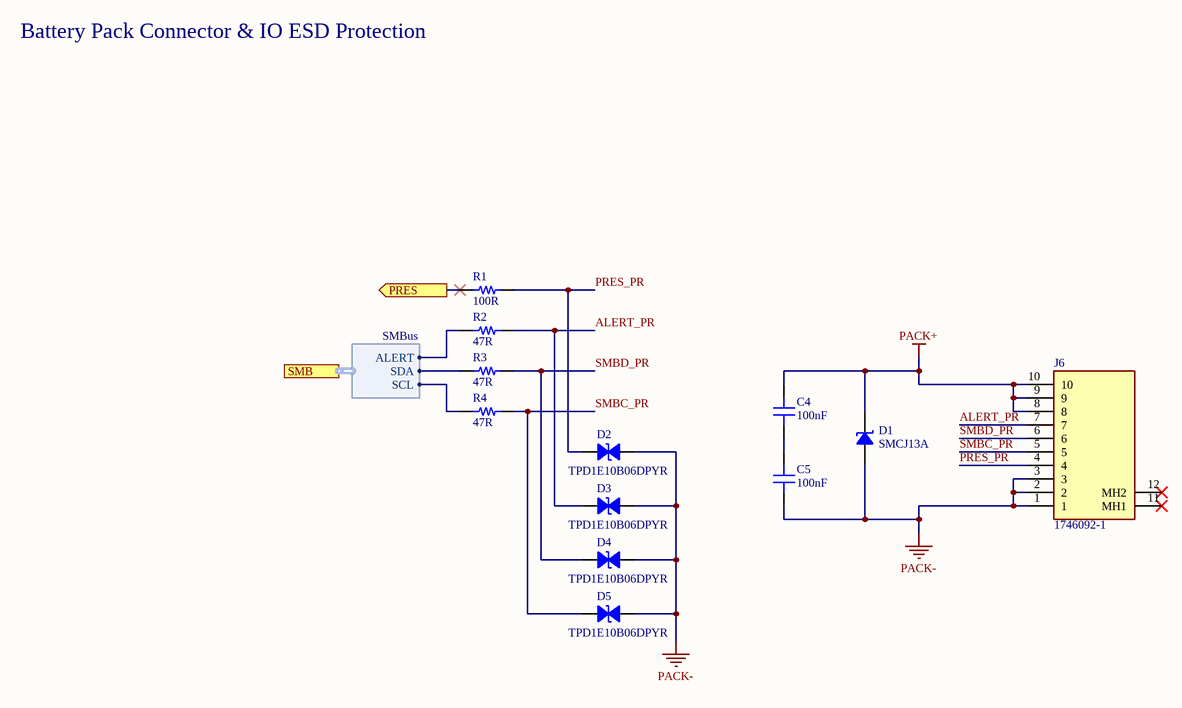
[diagram p4: Battery_Connector.SchDoc]

### Parts
(Parts that share a designator on the sheet are numbered #1, #2 ... from top to bottom, then left to right.)
?#5  (no value)  (graphical)
C4  100nF  [CAP 0603_1608]
C5  100nF  [CAP 0603_1608]
D1  SMCJ13A  [DO214AB SMC]
D2  TPD1E10B06DPYR  [0402]
D3  TPD1E10B06DPYR  [0402]
D4  TPD1E10B06DPYR  [0402]
D5  TPD1E10B06DPYR  [0402]
J6  1746092-1  [17460921]
R1  100R  [RES 0603_1608]
R2  47R  [RES 0603_1608]
R3  47R  [RES 0603_1608]
R4  47R  [RES 0603_1608]

### Ports
PRES (out, see Pack_BMS_Module[3B], Battery_Management[5C]), SMB (harness SMBus, see Pack_BMS_Module[3B], Battery_Management[6C])

### Harnesses
SMBus: ALERT, SDA, SCL

### Nets
PACK+: C4.2 D1.2 J6.8 J6.9 J6.10
PACK-: C5.1 D1.1 D2.1 D3.1 D4.1 D5.1 J6.1 J6.2 J6.3
ALERT_PR: D3.2 J6.7 R2.2
PRES_PR: D2.2 J6.4 R1.1
SMB.ALERT: R2.1 ; port SMB.ALERT
SMB.SCL: R4.1 ; port SMB.SCL
SMB.SDA: R3.1 ; port SMB.SDA
SMBC_PR: D5.2 J6.5 R4.2
SMBD_PR: D4.2 J6.6 R3.2
NetC4_1: C4.1 C5.2
NetR1_2: R1.2 ; port PRES

Not connected (* = marked no-connect by the designer): J6 11(MH1)* 12(MH2)*

### Notes on the sheet
- Battery Pack Connector & IO ESD Protection
- Sub-Project:
- Size:
- Drawn By:
- Revision:
- Date:
- File:
- Sheet:
- of

### Library data of the parts
?#5 = SGR-STDTBSA4: STANDARD SCHEMATICS TITLE BLOCK
C4 C5 = GEN-CC100NT10V25KX7R603: as C1 on sheet Cell_Connections; Part Number: GEN-CC100NT10V25KX7R603; Value: 100nF
D1 = SMCJ13A: TVS DIODE 13VWM 21.5VC DO214AB; Manufacturer: Littelfuse Inc.; Current - Peak Pulse (10/1000µs): 69.8A; Power Line Protection: No; Power - Peak Pulse: 1500W (1.5kW); Type: Zener; Unidirectional Channels: 1; Voltage - Breakdown (Min): 14.4V; Voltage - Clamping (Max) @ Ipp: 21.5V; Voltage - Reverse Standoff (Typ): 13V; Part Number: SMCJ13A; Applications: General Purpose; ComponentLink1Description: Datasheet; ComponentLink1URL: https://www.littelfuse.com/products/tvs-diodes/surface-mount/~/media/electronics/datasheets/tvs_diodes/littelfuse_tvs_diode_smcj_datasheet.pdf.pdf; ComponentLink2Description: DigiKey Link; ComponentLink2URL: https://www.digikey.com/en/products/detail/littelfuse-inc/SMCJ13A/762378; LastUpdated: 4/5/2026 8:33:56 PM; Lifecycle Status: Active; Minimum Order: 1; Mounting Type: Surface Mount; Operating Temperature: -55°C ~ 150°C (TJ); Package / Case: DO-214AB, SMC; Packaging: TapeAndReel; PartId: 6718; Part Status: Active; Price: 0.16; Series: SMCJ; Supplier 1: DigiKey; Supplier Part Number 1: SMCJ13ALFCT-ND; Supplier Device Package: DO-214AB (SMCJ)
D2-D5 = TPD1E10B06DPYR: TVS DIODE 5.5VWM 14VC 2X1SON; Manufacturer: Texas Instruments; Bidirectional Channels: 1; Current - Peak Pulse (10/1000µs): 5A (8/20µs); Power Line Protection: No; Power - Peak Pulse: 90W; Type: Zener; Voltage - Breakdown (Min): 6V; Voltage - Clamping (Max) @ Ipp: 14V; Voltage - Reverse Standoff (Typ): 5.5V (Max); Part Number: TPD1E10B06DPYR; Applications: General Purpose; ComponentLink1Description: Datasheet; ComponentLink1URL: http://www.ti.com/general/docs/suppproductinfo.tsp?distId=10&gotoUrl=http%3A%2F%2Fwww.ti.com%2Flit%2Fgpn%2Ftpd1e10b06; ComponentLink2Description: DigiKey Link; ComponentLink2URL: https://www.digikey.com/en/products/detail/texas-instruments/TPD1E10B06DPYR/3197744; Device Package: 0402 (1005 Metric); LastUpdated: 4/5/2026 9:01:53 PM; Lifecycle Status: Active; Minimum Order: 1; Mounting Type: Surface Mount; Operating Temperature: -40°C ~ 125°C (TA); Package / Case: 0402 (1005 Metric); Packaging: TapeAndReel; PartId: 10446; Part Status: Active; Price: 0.04; Series: -; Supplier 1: DigiKey; Supplier Part Number 1: 296-30406-1-ND; Supplier Device Package: 2-X1SON (1x.60)
J6 = 1746092-1: CONN PLUG 10POS 2.50MM R/A SLDR; Manufacturer: TE Connectivity AMP Connectors; Part Number: 1746092-1; Supplier 1: DigiKey; Supplier Part Number 1: A107791-ND
R1 = GEN-CRR100T1P8603: as R20 on sheet Battery_Management; Part Number: GEN-CRR100T1P8603; Value: 100R
R2-R4 = GEN-CRR47T1P8603: GENERIC 0603 CHIP RESISTOR; Tolerance: ±1%; Power: 0.125W; Part Number: GEN-CRR47T1P8603; Value: 47R

## Nets that join several sheets
GND: Cell_Connections (6 pins), Battery_Management (11 pins), Secondary_Protector (5 pins)
PACK+: Battery_Management (5 pins), Battery_Connector (5 pins)
PACK-: Battery_Management (7 pins), Battery_Connector (9 pins)
BC1: Cell_Connections (J2.3), Battery_Management (IC5.2 R23.1 R24.2), Secondary_Protector (R33.1)
BC2: Cell_Connections (J2.2), Battery_Management (IC4.2 R21.1 R22.2), Secondary_Protector (R32.1)
BC3: Cell_Connections (J2.1), Battery_Management (D6.2 R18.1 R19.2), Secondary_Protector (R29.2 R30.1)
BNEG: Cell_Connections (J2.4), Battery_Management (IC6.2 NT1.1 NT2.1 R25.1)
NetR1_2: Battery_Management (U1.7), Battery_Connector (R1.2)
NetR16_1: Battery_Management (R16.1), Secondary_Protector (U2.8)
PPW_N: Cell_Connections (J4.1), Battery_Management (6 pins)
PPW_P: Cell_Connections (J4.2), Battery_Management (C16.2 F1.1 IC7.1)
SMB.ALERT: Battery_Management (U1.5), Battery_Connector (R2.1)
SMB.SCL: Battery_Management (U1.2), Battery_Connector (R4.1)
SMB.SDA: Battery_Management (U1.1), Battery_Connector (R3.1)
TS1: Cell_Connections (C1.2 J1.1), Battery_Management (U1.26)
TS2: Cell_Connections (C2.2 J3.1), Battery_Management (U1.27)
TS3: Cell_Connections (C3.2 J5.1), Battery_Management (U1.28)